# EAGLE design untitled (EAGLE 7.4.0)
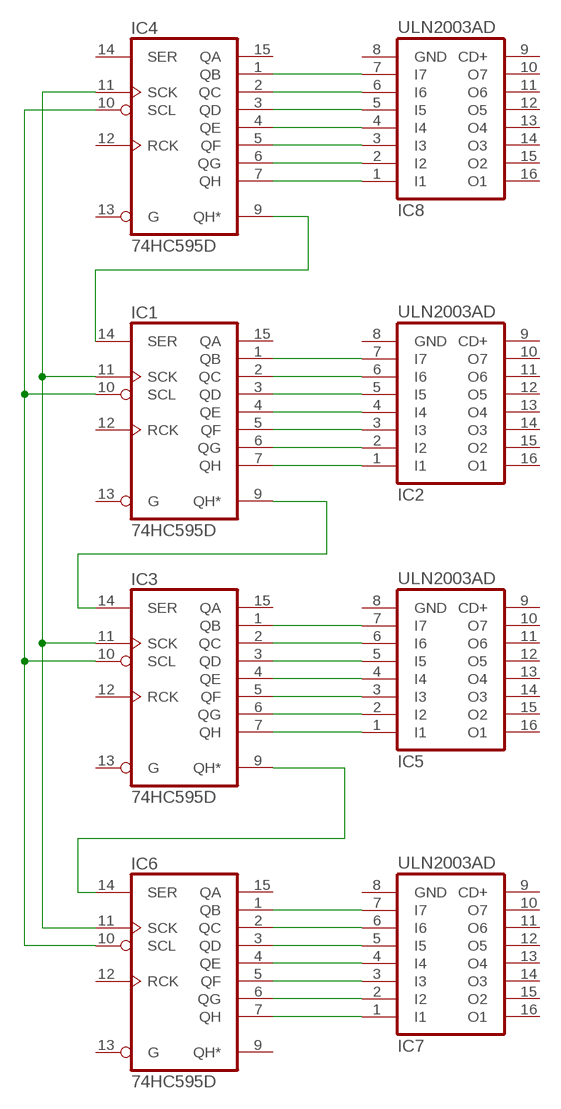
[diagram p0: schematic, sheet 1]

## Parts
IC1  74HC595D  [SO16]
IC2  ULN2003AD  [SO16]
IC3  74HC595D  [SO16]
IC4  74HC595D  [SO16]
IC5  ULN2003AD  [SO16]
IC6  74HC595D  [SO16]
IC7  ULN2003AD  [SO16]
IC8  ULN2003AD  [SO16]

## Nets
N$1: IC4.7(QH) IC8.1(I1)
N$2: IC4.6(QG) IC8.2(I2)
N$3: IC4.5(QF) IC8.3(I3)
N$4: IC4.4(QE) IC8.4(I4)
N$5: IC4.3(QD) IC8.5(I5)
N$6: IC4.2(QC) IC8.6(I6)
N$7: IC4.1(QB) IC8.7(I7)
N$8: IC1.7(QH) IC2.1(I1)
N$9: IC1.6(QG) IC2.2(I2)
N$10: IC1.5(QF) IC2.3(I3)
N$11: IC1.4(QE) IC2.4(I4)
N$12: IC1.3(QD) IC2.5(I5)
N$13: IC1.2(QC) IC2.6(I6)
N$14: IC1.1(QB) IC2.7(I7)
N$15: IC3.7(QH) IC5.1(I1)
N$16: IC3.6(QG) IC5.2(I2)
N$17: IC3.5(QF) IC5.3(I3)
N$18: IC3.4(QE) IC5.4(I4)
N$19: IC3.3(QD) IC5.5(I5)
N$20: IC3.2(QC) IC5.6(I6)
N$21: IC3.1(QB) IC5.7(I7)
N$22: IC6.7(QH) IC7.1(I1)
N$23: IC6.6(QG) IC7.2(I2)
N$24: IC6.5(QF) IC7.3(I3)
N$25: IC6.4(QE) IC7.4(I4)
N$26: IC6.3(QD) IC7.5(I5)
N$27: IC6.2(QC) IC7.6(I6)
N$28: IC6.1(QB) IC7.7(I7)
N$29: IC1.10(SCL) IC3.10(SCL) IC4.10(SCL) IC6.10(SCL)
N$30: IC1.11(SCK) IC3.11(SCK) IC4.11(SCK) IC6.11(SCK)
N$31: IC1.14(SER) IC4.9(QH*)
N$32: IC1.9(QH*) IC3.14(SER)
N$33: IC3.9(QH*) IC6.14(SER)
Unconnected: IC1.12(RCK) IC1.13(G) IC1.15(QA) IC2.9(CD+) IC2.10(O7) IC2.11(O6) IC2.12(O5) IC2.13(O4) IC2.14(O3) IC2.15(O2) IC2.16(O1) IC3.12(RCK) IC3.13(G) IC3.15(QA) IC4.12(RCK) IC4.13(G) IC4.14(SER) IC4.15(QA) IC5.9(CD+) IC5.10(O7) IC5.11(O6) IC5.12(O5) IC5.13(O4) IC5.14(O3) IC5.15(O2) IC5.16(O1) IC6.9(QH*) IC6.12(RCK) IC6.13(G) IC6.15(QA) IC7.9(CD+) IC7.10(O7) IC7.11(O6) IC7.12(O5) IC7.13(O4) IC7.14(O3) IC7.15(O2) IC7.16(O1) IC8.9(CD+) IC8.10(O7) IC8.11(O6) IC8.12(O5) IC8.13(O4) IC8.14(O3) IC8.15(O2) IC8.16(O1)

## Power pins joined to a net without a drawn wire
GND: IC1.8(GND) IC2.8(GND) IC3.8(GND) IC4.8(GND) IC5.8(GND) IC6.8(GND) IC7.8(GND) IC8.8(GND)
VCC: IC1.16(VCC) IC3.16(VCC) IC4.16(VCC) IC6.16(VCC)

## Library data of the parts
IC1 IC3 IC4 IC6 = 74xx-eu:74*595: 8-bit SHIFT REGISTER, output latch
IC2 IC5 IC7 IC8 = uln-udn:ULN2003A: DRIVER ARRAY

## Board
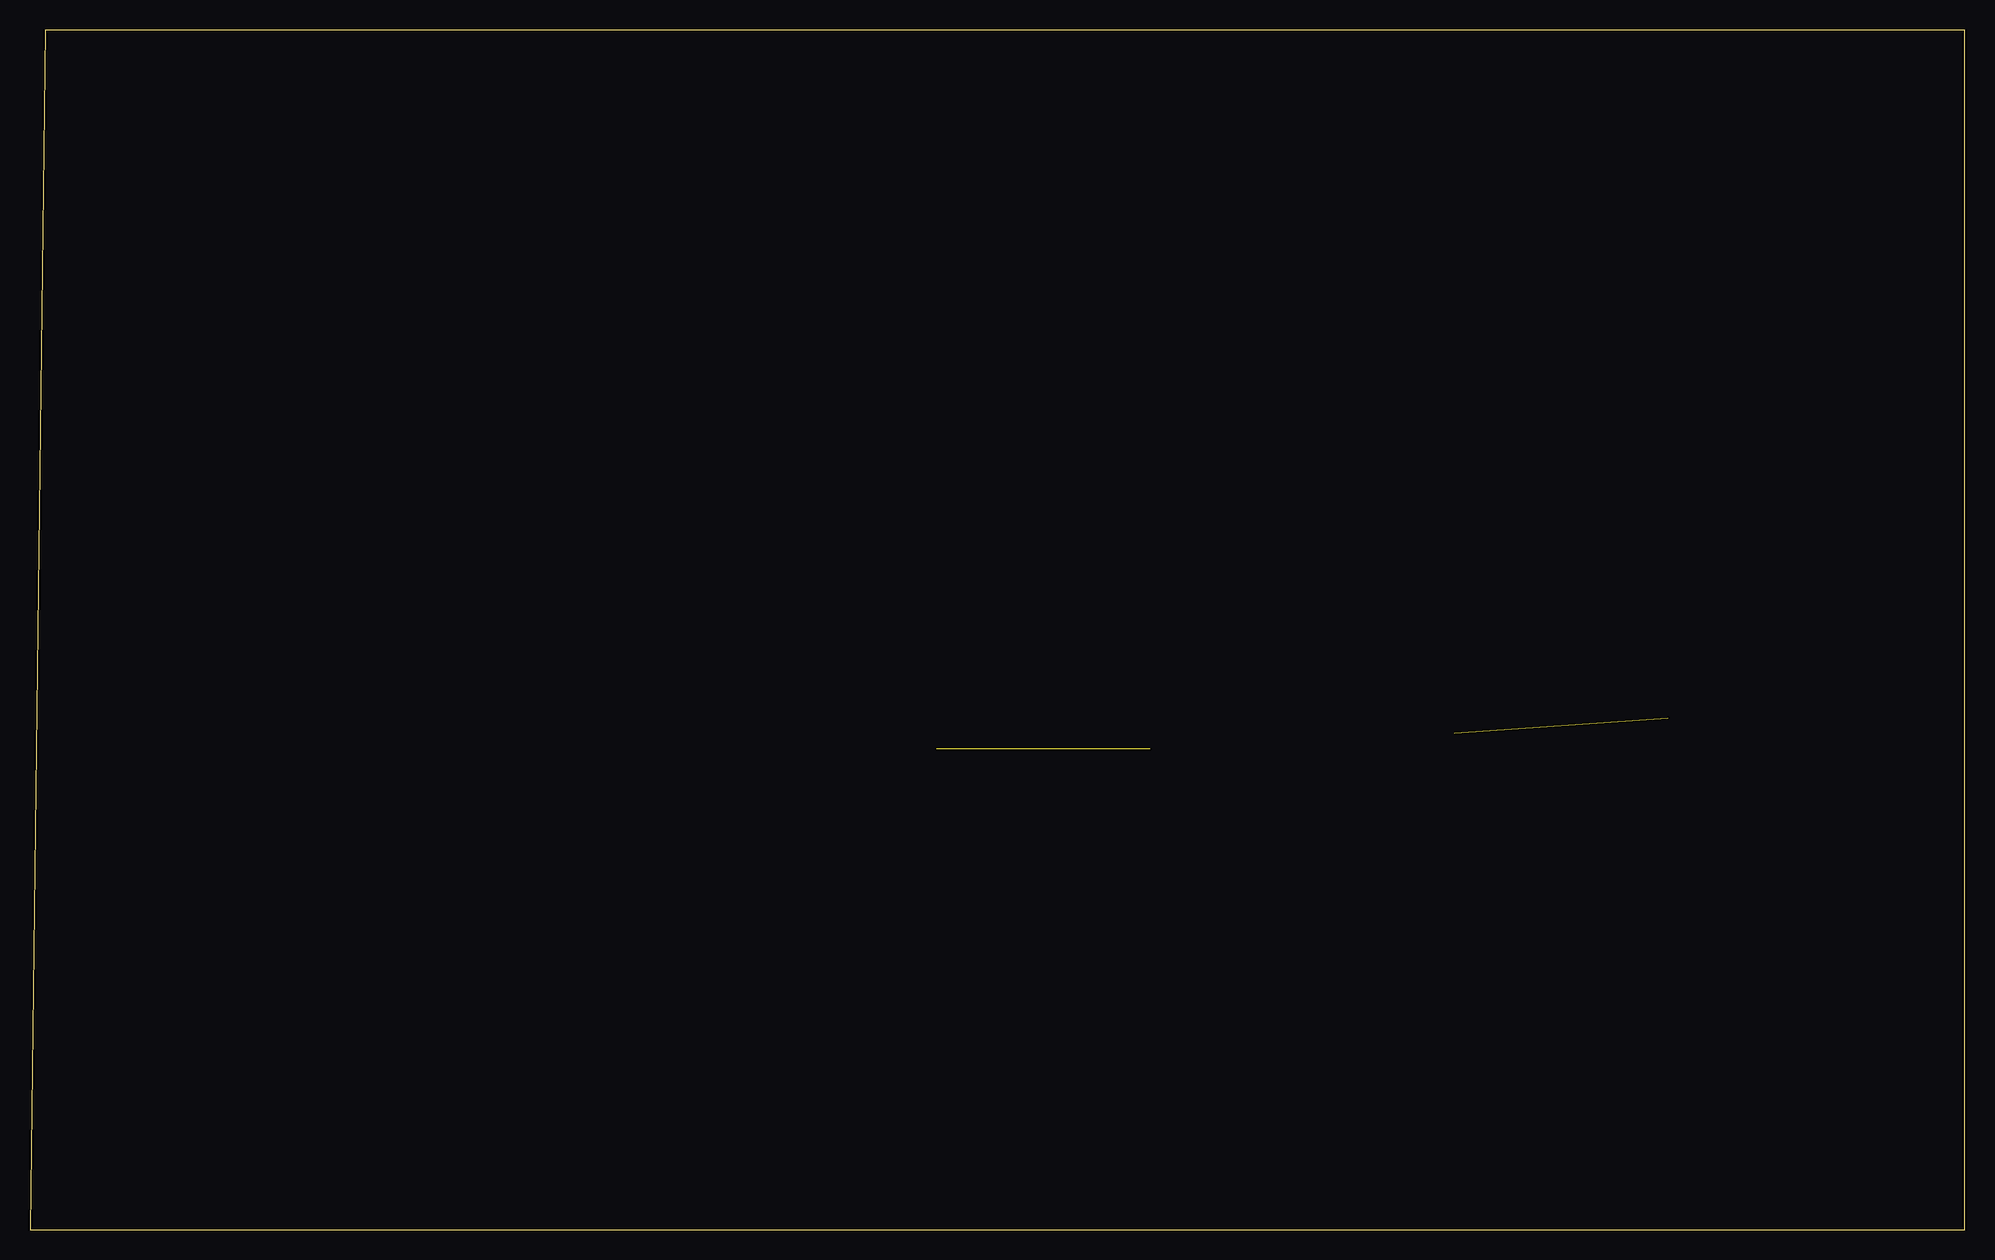
[diagram p1: board, top side]
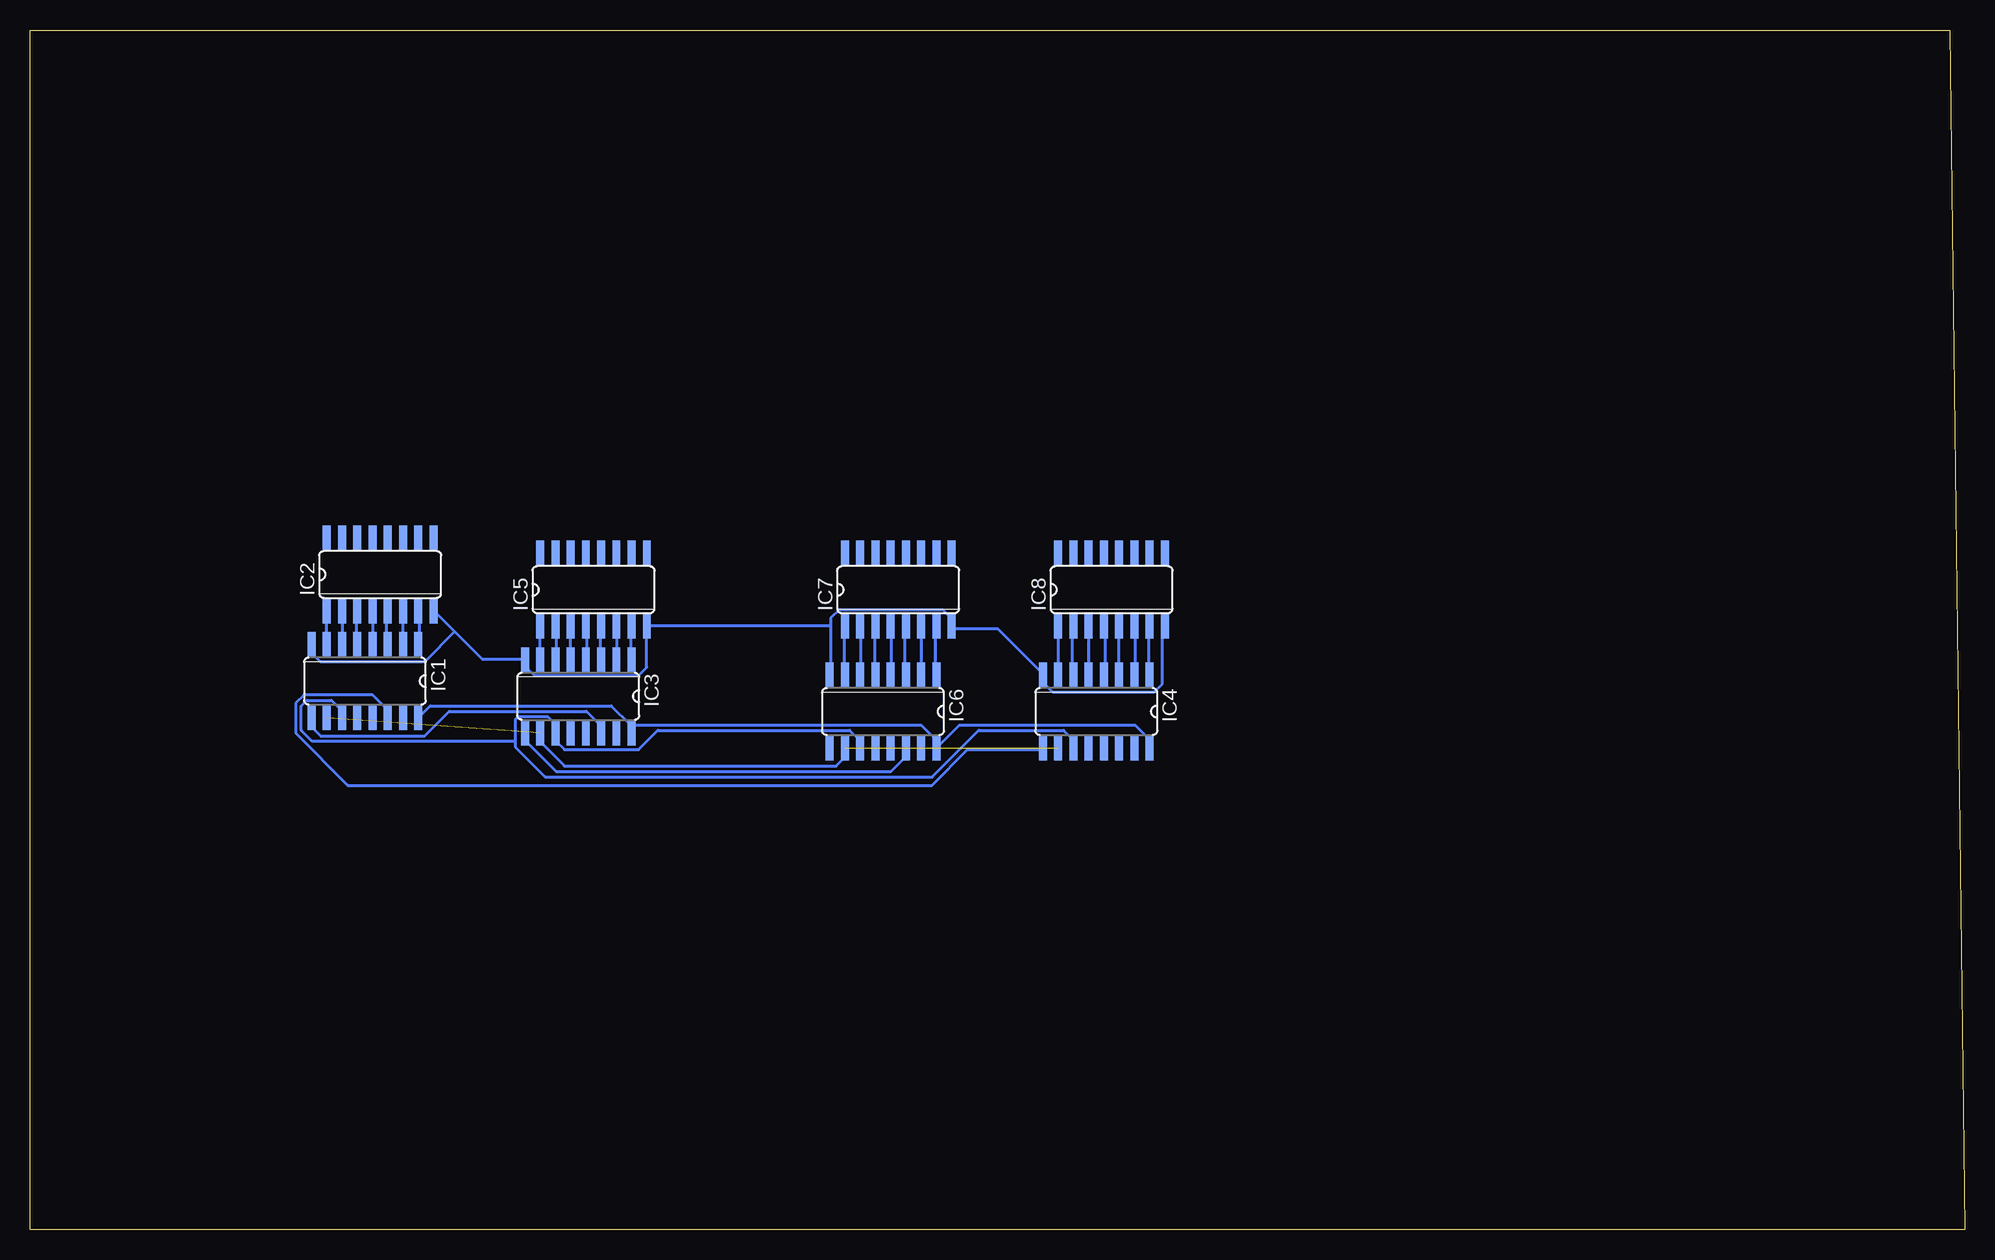
[diagram p2: board, bottom side, seen from below]

Size 161.27 x 100 mm. Coordinates in mm from the lower left corner, seen from the top.
Outline: 0,0 161.27,0 161.27,100 1.27,100 0,0
Copper layers (1*16): Top 0.035mm / dielectric 1.5mm / Bottom 0.035mm
Design rules "default": minimum track width 10mil, minimum drill 24mil, track to track 8mil, track to pad 8mil, pad to pad 8mil, via to via 8mil, smd to smd 8mil, copper to edge 40mil, drill to drill 8mil, minimum pad ring 10mil, minimum via ring 8mil, stop-mask expansion 4mil, vias tented up to drill 0mil, thermal gap 10mil

### Footprints (pad centres in the part's own frame; a part is rotated, then mirrored left to right if it is on the bottom)
SO16 = smd 0.66 x 2.032: 1 -4.445,-3.073; 2 -3.175,-3.073; 3 -1.905,-3.073; 4 -0.635,-3.073; 5 0.635,-3.073; 6 1.905,-3.073; 7 3.175,-3.073; 8 4.445,-3.073; 9 4.445,3.073; 10 3.175,3.073; 11 1.905,3.073; 12 0.635,3.073; 13 -0.635,3.073; 14 -1.905,3.073; 15 -3.175,3.073; 16 -4.445,3.073

### Placement (x,y rotation side)
IC1  133.35,45.72 180 bottom
IC2  132.08,54.61 0 bottom
IC3  115.57,44.45 180 bottom
IC4  72.39,43.18 180 bottom
IC5  114.3,53.34 0 bottom
IC6  90.17,43.18 180 bottom
IC7  88.9,53.34 0 bottom
IC8  71.12,53.34 0 bottom

### Tracks (layer width: path | path; a pad name or v marks a point on that pad's centre or on a via)
GND
  Bottom 0.254: 125.86,49.84 127.46,51.44 IC2.8 | 125.86,49.84 123.57,47.55 120.14,47.55 IC3.8 119.91,47.32 119.91,46.86 119.23,46.18 110.54,46.18 109.85,46.86 IC5.8 109.85,50.29 94.54,50.29 | 125.86,49.84 128.37,47.32 137.06,47.32 137.74,48.01 137.74,48.69 IC1.8 | IC8.8 66.88,50.06 66.88,45.49 67.56,44.81 76.02,44.81 76.71,45.49 76.71,46.18 IC4.8 76.94,46.41 80.59,50.06 84.25,50.06 IC7.8 84.48,50.29 84.48,50.98 85.17,51.66 93.85,51.66 94.54,50.98 94.54,50.29 | 94.54,50.29 94.54,46.41 IC6.8
N$1
  Bottom 0.254: IC8.1 IC4.7
N$2
  Bottom 0.254: IC4.6 74.42,46.41 74.42,50.06 IC8.2
N$3
  Bottom 0.254: IC4.5 73.05,46.41 73.05,50.06 IC8.3
N$4
  Bottom 0.254: IC4.4 71.68,46.41 71.68,50.06 IC8.4
N$5
  Bottom 0.254: IC4.3 70.54,46.41 70.54,50.06 IC8.5
N$6
  Bottom 0.254: IC4.2 69.16,46.41 69.16,50.06 IC8.6
N$7
  Bottom 0.254: IC4.1 68.02,46.41 68.02,50.06 IC8.7
N$8
  Bottom 0.254: IC1.7 136.6,48.92 136.6,51.44 IC2.1
N$9
  Bottom 0.254: IC1.6 135.23,48.92 135.23,51.44 IC2.2
N$10
  Bottom 0.254: IC1.5 134.09,48.92 134.09,51.44 IC2.3
N$11
  Bottom 0.254: IC2.4 IC1.4
N$12
  Bottom 0.254: IC1.3 131.57,48.92 131.57,51.44 IC2.5
N$13
  Bottom 0.254: IC1.2 130.2,48.92 130.2,51.44 IC2.6
N$14
  Bottom 0.254: IC1.1 128.83,48.92 128.83,51.44 IC2.7
N$15
  Bottom 0.254: IC3.7 118.77,47.55 118.77,50.06 IC5.1
N$16
  Bottom 0.254: IC3.6 117.4,47.55 117.4,50.06 IC5.2
N$17
  Bottom 0.254: IC3.5 116.26,47.55 116.26,50.06 IC5.3
N$18
  Bottom 0.254: IC3.4 114.88,47.55 114.88,50.06 IC5.4
N$19
  Bottom 0.254: IC3.3 113.74,47.55 113.74,50.06 IC5.5
N$20
  Bottom 0.254: IC3.2 112.37,47.55 112.37,50.06 IC5.6
N$21
  Bottom 0.254: IC3.1 111.23,47.55 111.23,50.06 IC5.7
N$22
  Bottom 0.254: IC6.7 93.4,46.41 93.4,50.06 IC7.1
N$23
  Bottom 0.254: IC6.6 92.02,46.41 92.02,50.06 IC7.2
N$24
  Bottom 0.254: IC6.5 90.88,46.41 90.88,50.06 IC7.3
N$25
  Bottom 0.254: IC6.4 89.51,46.41 89.51,50.06 IC7.4
N$26
  Bottom 0.254: IC6.3 88.37,46.41 88.37,50.06 IC7.5
N$27
  Bottom 0.254: IC7.6 IC6.2
N$28
  Bottom 0.254: IC6.1 85.85,46.41 85.85,50.06 IC7.7
N$29  (2 unrouted)
  Bottom 0.254: IC6.10 93.4,40.01 93.4,39.32 94.08,38.63 116.71,38.63 118.54,40.46 118.54,41.38 IC3.10
N$30
  Bottom 0.254: 120.83,40.69 120.83,42.52 120.6,42.75 118.08,42.75 117.63,42.29 117.63,41.38 IC3.11 117.4,41.38 117.4,40.69 116.71,40.01 110.54,40.01 108.94,41.6 92.94,41.6 92.25,40.92 92.25,40.23 IC6.11 | 120.83,40.69 120.83,40.23 118.31,37.72 86.08,37.72 82.19,41.6 75.11,41.6 74.42,40.92 74.42,40.23 IC4.11 | 120.83,40.69 137.74,40.69 138.66,41.6 138.66,43.66 138.2,44.12 136.14,44.12 135.46,43.43 135.46,42.75 IC1.11
N$31
  Bottom 0.254: IC4.9 76.94,40.01 83.11,40.01 86.08,37.03 134.77,37.03 139.12,41.38 139.12,43.89 138.43,44.58 132.72,44.58 131.57,43.43 131.57,42.75 IC1.14
N$32
  Bottom 0.254: IC3.14 113.74,41.38 113.74,42.06 114.88,43.2 126.31,43.2 128.37,41.15 137.06,41.15 137.74,41.83 137.74,42.52 IC1.9
N$33
  Bottom 0.254: IC6.14 88.37,40.01 88.37,39.32 89.51,38.18 117.4,38.18 119.91,40.69 119.91,41.38 IC3.9
VCC
  Bottom 0.254: 85.39,40.46 85.62,40.23 IC6.16 | 85.39,40.46 83.8,42.06 69.16,42.06 68.02,40.92 68.02,40.23 IC4.16 | 111.23,42.06 111.23,41.38 IC3.16 111.23,42.06 | 111.23,42.06 112.83,43.66 127.91,43.66 128.83,42.75 IC1.16 | 85.39,40.46 86.99,42.06 111.23,42.06